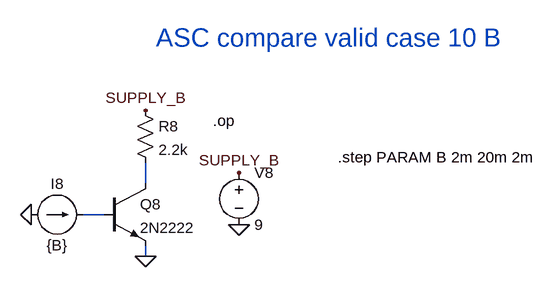
[diagram p0: schematic valid_case_10_b.asc]
valid_case_10_b.asc, the LTspice schematic file:
Version 4.1
SHEET 1 976 680
WIRE 160 96 160 64
WIRE 96 144 64 144
WIRE 160 208 160 192
FLAG 160 -16 SUPPLY_B
FLAG 304 80 SUPPLY_B
FLAG -16 144 0
FLAG 160 208 0
FLAG 304 160 0
SYMBOL current -16 144 R270
WINDOW 0 32 40 VTop 2
WINDOW 3 -32 40 VBottom 2
WINDOW 123 0 0 Left 2
WINDOW 39 0 0 Left 2
SYMATTR InstName I8
SYMATTR Value {B}
SYMBOL npn 96 96 R0
SYMATTR InstName Q8
SYMATTR Value 2N2222
SYMBOL voltage 304 64 R0
WINDOW 123 0 0 Left 2
WINDOW 39 0 0 Left 2
SYMATTR InstName V8
SYMATTR Value 9
SYMBOL res 144 -32 R0
SYMATTR InstName R8
SYMATTR Value 2.2k
TEXT 456 56 Left 2 !.step PARAM B 2m 20m 2m
TEXT 264 0 Left 2 !.op
TEXT 176 -128 Left 4 ;ASC compare valid case 10 B

The netlist it stands for:
* valid_case_10_b.asc
I8 0 N002 {B}
Q8 N001 N002 0 0 2N2222
V8 SUPPLY_B 0 9
R8 SUPPLY_B N001 2.2k
.model NPN NPN
.model PNP PNP
.lib standard.bjt
.step PARAM B 2m 20m 2m
.op
* ASC compare valid case 10 B
.backanno
.end